# Altium project Etage Reception 1.PrjPcb
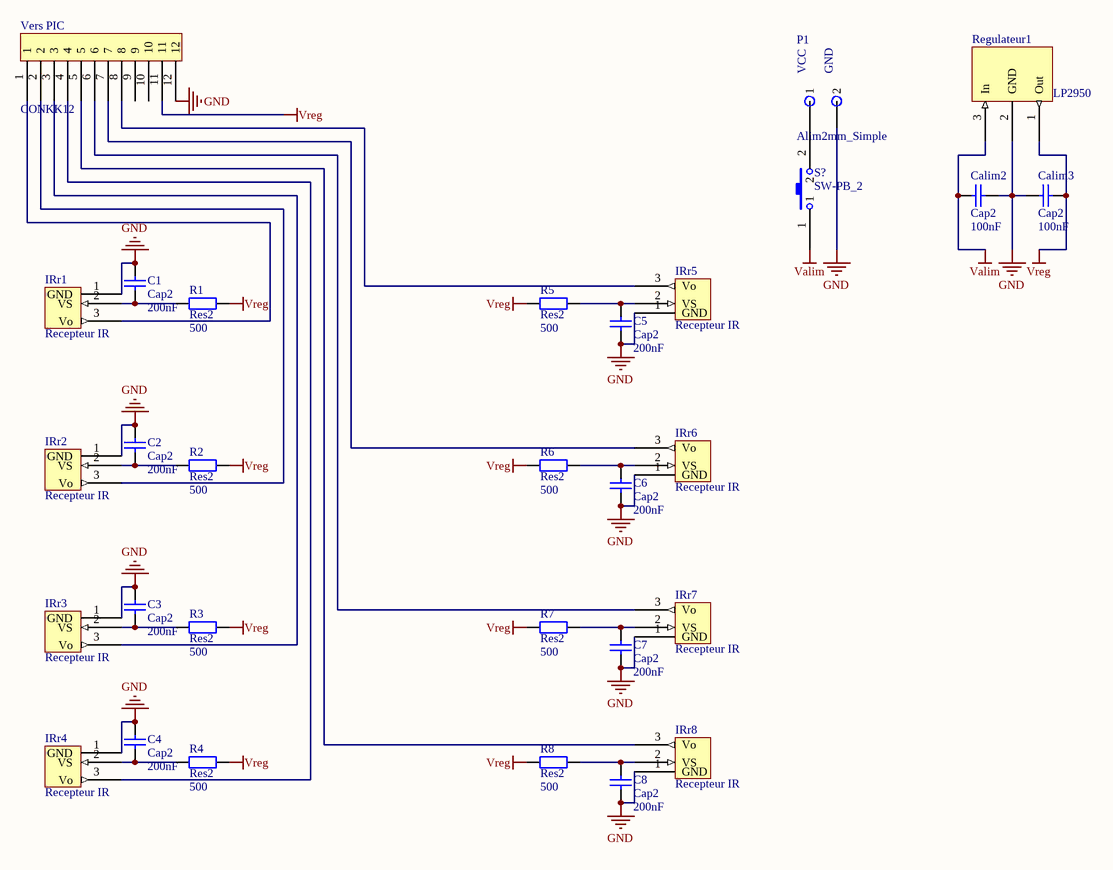
[diagram p0: Etage Reception 1.SchDoc]
1 sheet, 30 parts. Net scope: global (net labels, ports and power ports of the same name join across sheets).
Board file: Etage Reception 1.PcbDoc

## Sheet Etage Reception 1.SchDoc
size A4

### Parts
C1  Cap2  value 200nF  [CAPA2]
C2  Cap2  value 200nF  [CAPA2]
C3  Cap2  value 200nF  [CAPA2]
C4  Cap2  value 200nF  [CAPA2]
C5  Cap2  value 200nF  [CAPA2]
C6  Cap2  value 200nF  [CAPA2]
C7  Cap2  value 200nF  [CAPA2]
C8  Cap2  value 200nF  [CAPA2]
Calim2  Cap2  value 100nF  [CAPA2]
Calim3  Cap2  value 100nF  [CAPA2]
IRr1  Recepteur IR  [TSOP1138]
IRr2  Recepteur IR  [TSOP1138]
IRr3  Recepteur IR  [TSOP1138]
IRr4  Recepteur IR  [TSOP1138]
IRr5  Recepteur IR  [TSOP1138]
IRr6  Recepteur IR  [TSOP1138]
IRr7  Recepteur IR  [TSOP1138]
IRr8  Recepteur IR  [TSOP1138]
P1  Alim2mm_Simple  [Alim2mm_simple]
R1  Res2  value 500  [res5_1/4W]
R2  Res2  value 500  [res5_1/4W]
R3  Res2  value 500  [res5_1/4W]
R4  Res2  value 500  [res5_1/4W]
R5  Res2  value 500  [res5_1/4W]
R6  Res2  value 500  [res5_1/4W]
R7  Res2  value 500  [res5_1/4W]
R8  Res2  value 500  [res5_1/4W]
Regulateur1  LP2950  [PCBComponent_1]
S?  SW-PB_2  [SW_BP_2]
Vers_PIC  CONKK12  [CONKK12]

### Nets
GND: C1.2 C2.2 C3.2 C4.2 C5.2 C6.2 C7.2 C8.2 Calim2.2 Calim3.1 IRr1.1(GND) IRr2.1(GND) IRr3.1(GND) IRr4.1(GND) IRr5.1(GND) IRr6.1(GND) IRr7.1(GND) IRr8.1(GND) P1.2 Regulateur1.2(GND) Vers_PIC.12
Valim: Calim2.1 Regulateur1.3(In) S?.1
Vreg: Calim3.2 R1.2 R2.2 R3.2 R4.2 R5.2 R6.2 R7.2 R8.2 Regulateur1.1(Out) Vers_PIC.11
NetC1_1: C1.1 IRr1.2(VS) R1.1
NetC2_1: C2.1 IRr2.2(VS) R2.1
NetC3_1: C3.1 IRr3.2(VS) R3.1
NetC4_1: C4.1 IRr4.2(VS) R4.1
NetC5_1: C5.1 IRr5.2(VS) R5.1
NetC6_1: C6.1 IRr6.2(VS) R6.1
NetC7_1: C7.1 IRr7.2(VS) R7.1
NetC8_1: C8.1 IRr8.2(VS) R8.1
NetIRr1_3: IRr1.3(Vo) Vers_PIC.1
NetIRr2_3: IRr2.3(Vo) Vers_PIC.2
NetIRr3_3: IRr3.3(Vo) Vers_PIC.3
NetIRr4_3: IRr4.3(Vo) Vers_PIC.4
NetIRr5_3: IRr5.3(Vo) Vers_PIC.8
NetIRr6_3: IRr6.3(Vo) Vers_PIC.7
NetIRr7_3: IRr7.3(Vo) Vers_PIC.6
NetIRr8_3: IRr8.3(Vo) Vers_PIC.5
NetP1_1: P1.1 S?.2

Not connected (* = marked no-connect by the designer): Vers_PIC 9 10

### Notes on the sheet
- (in symbol Alim2mm_Simple) VCC; GND

### Library data of the parts
C1-C8 Calim2 Calim3 = Cap2: Capacitor; Published: 8-Jun-2000; LatestRevisionDate: 17-Jul-2002; LatestRevisionNote: Re-released for DXP Platform.; PackageReference: RAD-0.3; Publisher: Altium Limited
IRr1-IRr8 = TSOP1138: pin to pad: 1>GND 2>Vs 3>Vo
P1 = Alim2mm_Simple: 2-Pin; LatestRevisionDate: 17-Jul-2002; LatestRevisionNote: Re-released for DXP Platform.; Publisher: Altium Limited
R1-R8 = Res2: Resistor; Published: 8-Jun-2000; LatestRevisionDate: 17-Jul-2002; LatestRevisionNote: Re-released for DXP Platform.; PackageReference: AXIAL-0.4; Publisher: Altium Limited
Regulateur1 = LP2950: pin to pad: 1>Out 2>GND 3>In
S? = SW-PB_2: Switch; Published: 24-Mar-1999; LatestRevisionDate: 17-Jul-2002; LatestRevisionNote: Re-released for DXP Platform.; PackageReference: SPST-2; Publisher: Altium Limited